# Altium schematic sheet final_project.SchDoc
size 500 x 500 mm
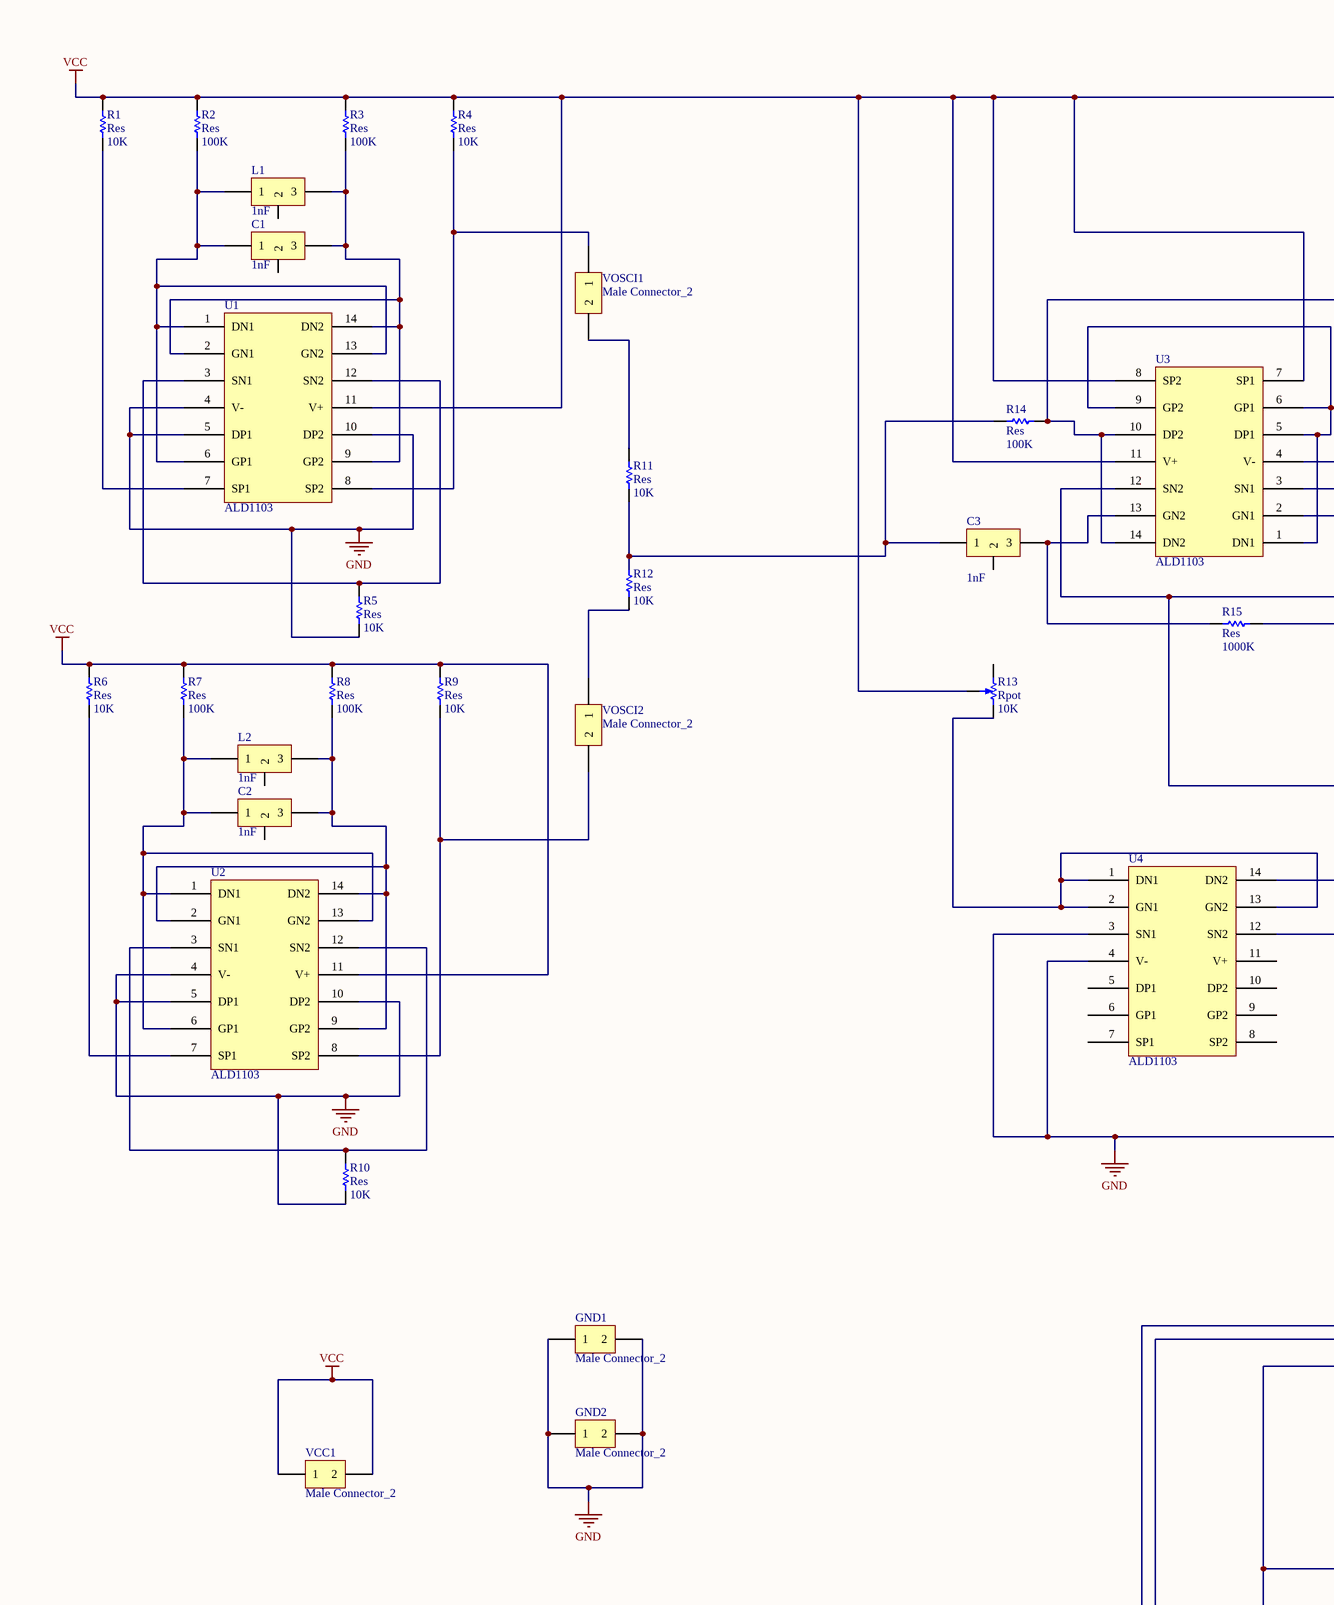
[diagram p0: final_project.SchDoc, left]
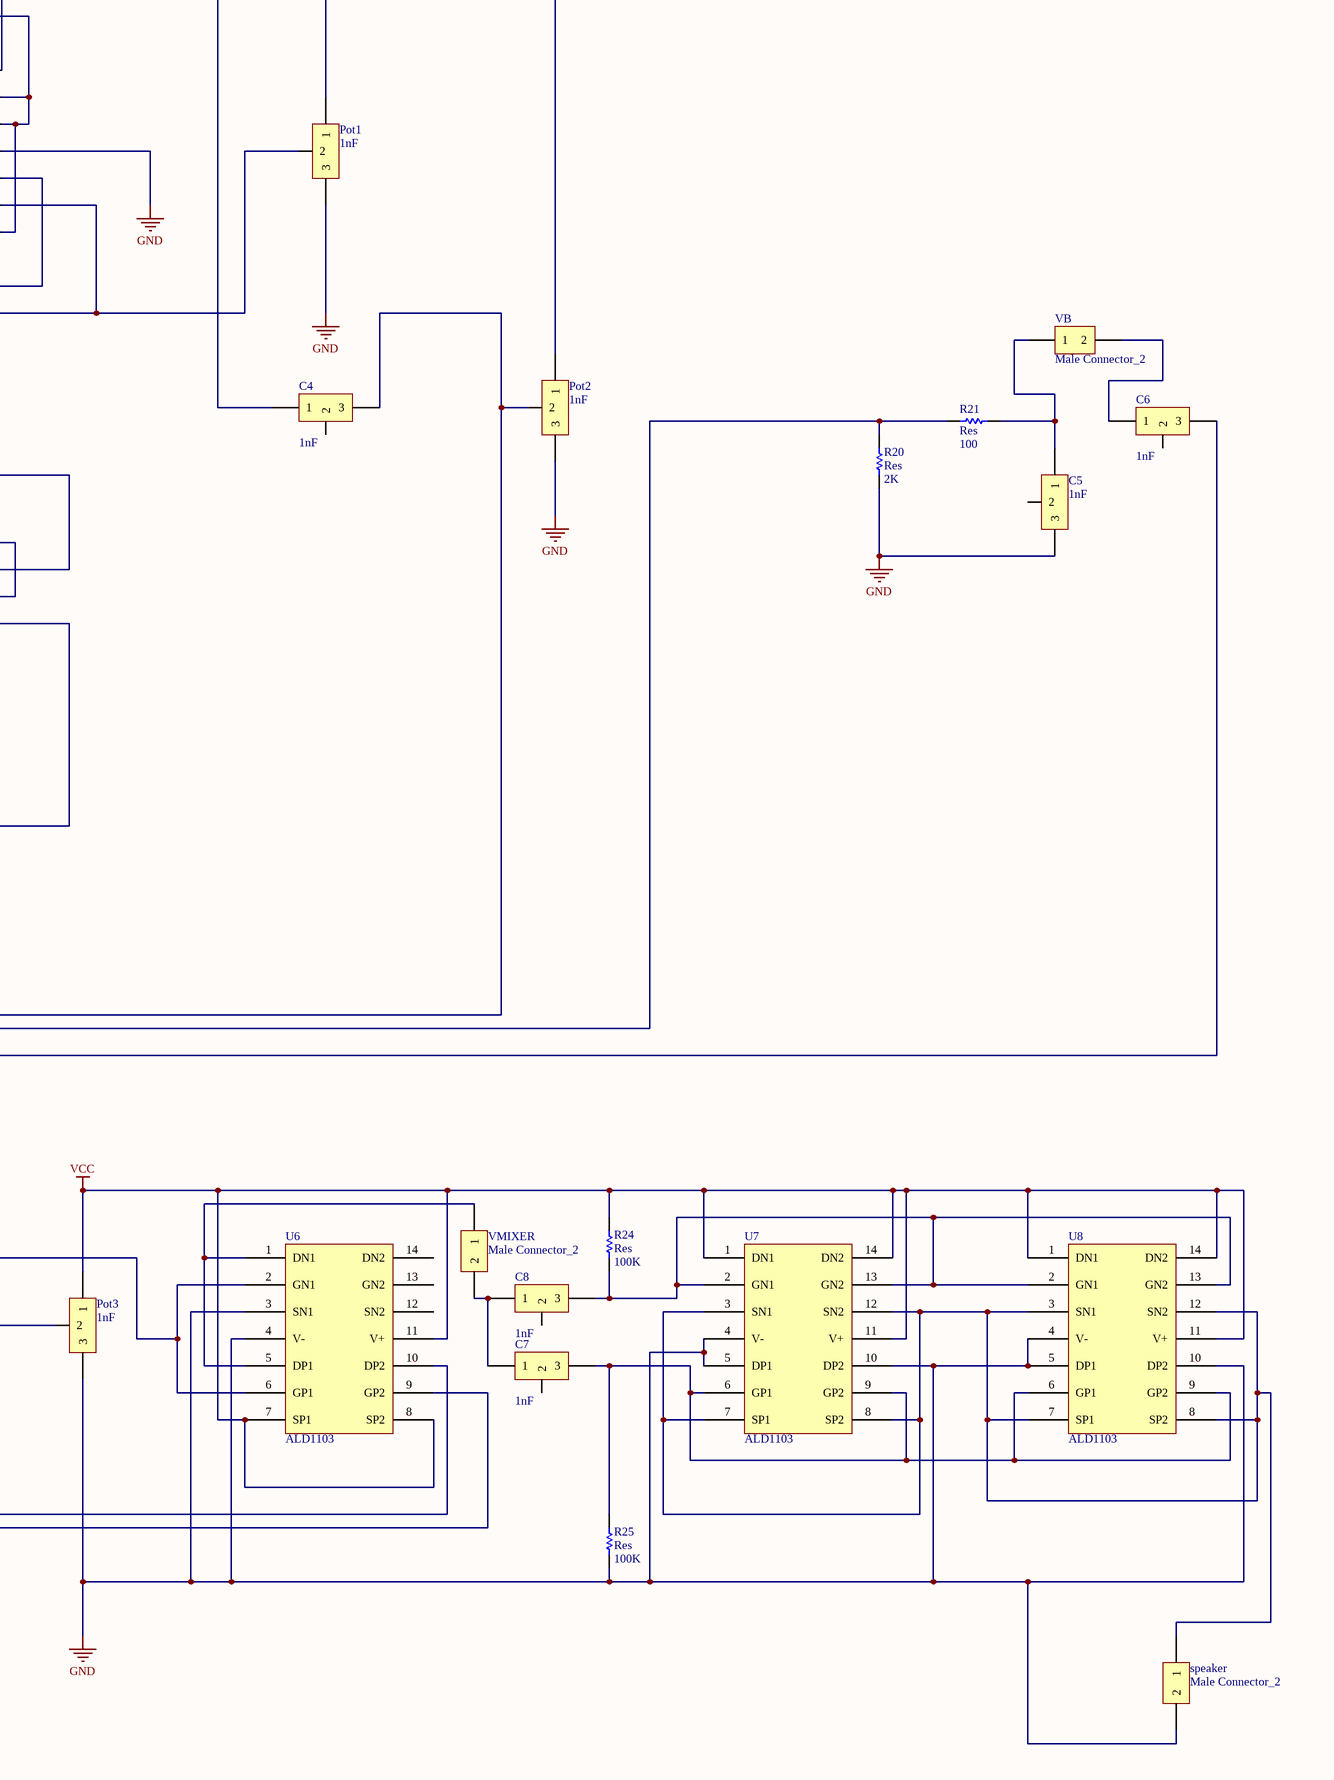
[diagram p1: final_project.SchDoc, right]

## Parts
C1  value 1nF  [Connector_3]  (hidden comment: Female Connector_3)
C2  value 1nF  [Connector_3]  (hidden comment: Female Connector_3)
C3  value 1nF  [Connector_3]  (hidden comment: Female Connector_3)
C4  value 1nF  [Connector_3]  (hidden comment: Female Connector_3)
C5  value 1nF  [Connector_3]  (hidden comment: Female Connector_3)
C6  value 1nF  [Connector_3]  (hidden comment: Female Connector_3)
C7  value 1nF  [Connector_3]  (hidden comment: Female Connector_3)
C8  value 1nF  [Connector_3]  (hidden comment: Female Connector_3)
GND1  Male Connector_2  [Connector_2]
GND2  Male Connector_2  [Connector_2]
L1  value 1nF  [Connector_3]  (hidden comment: Female Connector_3)
L2  value 1nF  [Connector_3]  (hidden comment: Female Connector_3)
Pot1  value 1nF  [Connector_3]  (hidden comment: Female Connector_3)
Pot2  value 1nF  [Connector_3]  (hidden comment: Female Connector_3)
Pot3  value 1nF  [Connector_3]  (hidden comment: Female Connector_3)
R1  Res  value 10K  [RES]
R2  Res  value 100K  [RES]
R3  Res  value 100K  [RES]
R4  Res  value 10K  [RES]
R5  Res  value 10K  [RES]
R6  Res  value 10K  [RES]
R7  Res  value 100K  [RES]
R8  Res  value 100K  [RES]
R9  Res  value 10K  [RES]
R10  Res  value 10K  [RES]
R11  Res  value 10K  [RES]
R12  Res  value 10K  [RES]
R13  Rpot  value 10K  [Rpot10]
R14  Res  value 100K  [RES]
R15  Res  value 1000K  [RES]
R20  Res  value 2K  [RES]
R21  Res  value 100  [RES]
R24  Res  value 100K  [RES]
R25  Res  value 100K  [RES]
speaker  Male Connector_2  [Connector_2]
U1  ALD1103  [ALD1103]
U2  ALD1103  [ALD1103]
U3  ALD1103  [ALD1103]
U4  ALD1103  [ALD1103]
U6  ALD1103  [ALD1103]
U7  ALD1103  [ALD1103]
U8  ALD1103  [ALD1103]
VB  Male Connector_2  [Connector_2]
VCC1  Male Connector_2  [Connector_2]
VMIXER  Male Connector_2  [Connector_2]
VOSCI1  Male Connector_2  [Connector_2]
VOSCI2  Male Connector_2  [Connector_2]

## Nets
GND: C5.3 GND1.1 GND1.2 GND2.1 GND2.2 Pot1.3 Pot2.3 Pot3.3 R5.1 R10.1 R20.1 R25.1 speaker.2 U1.4(V-) U1.5(DP1) U1.10(DP2) U2.4(V-) U2.5(DP1) U2.10(DP2) U3.4(V-) U4.3(SN1) U4.4(V-) U4.12(SN2) U6.3(SN1) U6.4(V-) U7.4(V-) U7.5(DP1) U7.10(DP2) U8.4(V-) U8.5(DP1) U8.10(DP2)
VCC: Pot1.1 Pot2.1 Pot3.1 R1.2 R2.2 R3.2 R4.2 R6.2 R7.2 R8.2 R9.2 R13.3 R24.2 U1.11(V+) U2.11(V+) U3.7(SP1) U3.8(SP2) U3.11(V+) U6.7(SP1) U6.8(SP2) U6.11(V+) U7.1(DN1) U7.11(V+) U7.14(DN2) U8.1(DN1) U8.11(V+) U8.14(DN2) VCC1.1 VCC1.2
NetC1_1: C1.1 L1.1 R2.1 U1.1(DN1) U1.6(GP1) U1.13(GN2)
NetC1_3: C1.3 L1.3 R3.1 U1.2(GN1) U1.9(GP2) U1.14(DN2)
NetC2_1: C2.1 L2.1 R7.1 U2.1(DN1) U2.6(GP1) U2.13(GN2)
NetC2_3: C2.3 L2.3 R8.1 U2.2(GN1) U2.9(GP2) U2.14(DN2)
NetC3_1: C3.1 R11.1 R12.2 R14.1
NetC3_3: C3.3 R15.2 U3.13(GN2)
NetC4_1: C4.1 R14.2 U3.10(DP2) U3.14(DN2)
NetC4_3: C4.3 Pot2.2 U6.9(GP2)
NetC5_1: C5.1 R21.1 VB.1
NetC6_1: C6.1 VB.2
NetC6_3: C6.3 Pot3.2 U6.2(GN1) U6.6(GP1)
NetC7_1: C7.1 C8.1 VMIXER.2
NetC7_3: C7.3 R25.2 U7.6(GP1) U7.9(GP2) U8.6(GP1) U8.9(GP2)
NetC8_3: C8.3 R24.1 U7.2(GN1) U7.13(GN2) U8.2(GN1) U8.13(GN2)
NetPot1_2: Pot1.2 R15.1 U3.2(GN1)
NetR1_1: R1.1 U1.7(SP1)
NetR4_1: R4.1 U1.8(SP2) VOSCI1.1
NetR5_2: R5.2 U1.3(SN1) U1.12(SN2)
NetR6_1: R6.1 U2.7(SP1)
NetR9_1: R9.1 U2.8(SP2) VOSCI2.2
NetR10_2: R10.2 U2.3(SN1) U2.12(SN2)
NetR11_2: R11.2 VOSCI1.2
NetR12_1: R12.1 VOSCI2.1
NetR13_2: R13.2 U4.1(DN1) U4.2(GN1) U4.13(GN2)
NetR20_2: R20.2 R21.2 U6.10(DP2)
Netspeaker_1: speaker.1 U7.3(SN1) U7.7(SP1) U7.8(SP2) U7.12(SN2) U8.3(SN1) U8.7(SP1) U8.8(SP2) U8.12(SN2)
NetU3_1: U3.1(DN1) U3.5(DP1) U3.6(GP1) U3.9(GP2)
NetU3_3: U3.3(SN1) U3.12(SN2) U4.14(DN2)
NetU6_1: U6.1(DN1) U6.5(DP1) VMIXER.1

Not connected (* = marked no-connect by the designer): C1 2; C2 2; C3 2; C4 2; C5 2; C6 2; C7 2; C8 2; L1 2; L2 2; R13 1(-); U4 5(DP1) 6(GP1) 7(SP1) 8(SP2) 9(GP2) 10(DP2) 11(V+); U6 12(SN2) 13(GN2) 14(DN2)

## Library data of the parts
R1-R12 R14 R15 R20 R21 R24 R25 = Resistor
R13 = Rpot_10K